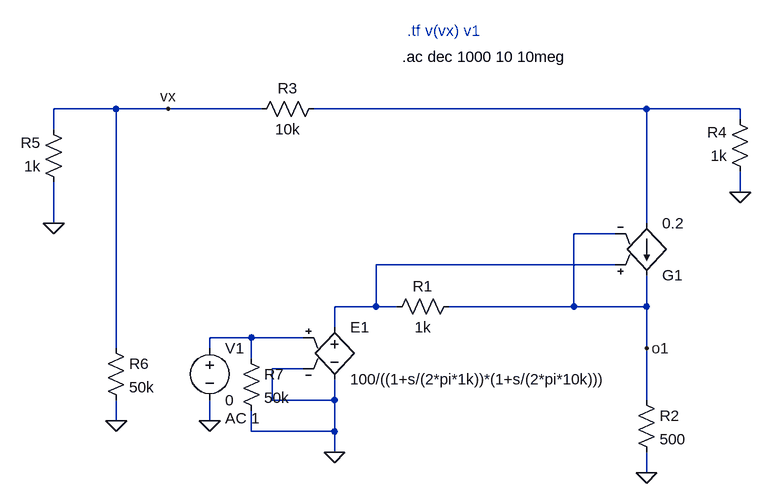
[diagram p0: schematic pruebametodo4.asc]
pruebametodo4.asc, the LTspice schematic file:
Version 4
SHEET 1 1112 1092
WIRE -96 -208 -192 -208
WIRE -16 -208 -96 -208
WIRE 128 -208 -16 -208
WIRE 720 -208 208 -208
WIRE 864 -208 720 -208
WIRE 864 -192 864 -208
WIRE -192 -176 -192 -208
WIRE 864 -80 864 -112
WIRE -192 -32 -192 -96
WIRE 720 -32 720 -208
WIRE 672 -16 608 -16
WIRE 672 32 304 32
WIRE 304 96 304 32
WIRE 304 96 240 96
WIRE 336 96 304 96
WIRE 608 96 608 -16
WIRE 608 96 416 96
WIRE 720 96 720 48
WIRE 720 96 608 96
WIRE 240 128 240 96
WIRE 112 144 48 144
WIRE 192 144 112 144
WIRE -96 160 -96 -208
WIRE 48 160 48 144
WIRE 720 160 720 96
WIRE 112 176 112 144
WIRE 192 192 144 192
WIRE 144 240 144 192
WIRE 240 240 240 208
WIRE 240 240 144 240
WIRE 720 240 720 160
WIRE -96 272 -96 240
WIRE 48 272 48 240
WIRE 112 288 112 256
WIRE 240 288 240 240
WIRE 240 288 112 288
WIRE 240 320 240 288
WIRE 720 352 720 320
FLAG 240 320 0
FLAG 720 352 0
FLAG 720 160 o1
FLAG -192 -32 0
FLAG 864 -80 0
FLAG -96 272 0
FLAG 48 272 0
FLAG -16 -208 vx
SYMBOL e 240 112 R0
SYMATTR InstName E1
SYMATTR Value 100/((1+s/(2*pi*1k))*(1+s/(2*pi*10k)))
SYMATTR SpiceModel laplace
SYMBOL res 320 112 R270
WINDOW 0 32 56 VTop 2
WINDOW 3 0 56 VBottom 2
SYMATTR InstName R1
SYMATTR Value 1k
SYMBOL g 720 64 M180
SYMATTR InstName G1
SYMATTR Value 0.2
SYMBOL res 704 224 R0
SYMATTR InstName R2
SYMATTR Value 500
SYMBOL res -176 -80 R180
WINDOW 0 36 76 Left 2
WINDOW 3 36 40 Left 2
SYMATTR InstName R5
SYMATTR Value 1k
SYMBOL res -112 144 R0
SYMATTR InstName R6
SYMATTR Value 50k
SYMBOL res 224 -224 R90
WINDOW 0 0 56 VBottom 2
WINDOW 3 32 56 VTop 2
SYMATTR InstName R3
SYMATTR Value 10k
SYMBOL res 880 -96 R180
WINDOW 0 36 76 Left 2
WINDOW 3 36 40 Left 2
SYMATTR InstName R4
SYMATTR Value 1k
SYMBOL voltage 48 144 R0
WINDOW 123 24 124 Left 2
WINDOW 39 0 0 Left 0
SYMATTR Value2 AC 1
SYMATTR InstName V1
SYMATTR Value 0
SYMBOL res 96 160 R0
SYMATTR InstName R7
SYMATTR Value 50k
TEXT 352 -328 Left 2 ;.tf v(vx) v1
TEXT 344 -288 Left 2 !.ac dec 1000 10 10meg

The netlist it stands for:
* pruebametodo4.asc
E1 N002 0 N003 0 laplace 100/((1+s/(2*pi*1k))*(1+s/(2*pi*10k)))
R1 N002 o1 1k
G1 N001 o1 N002 o1 0.2
R2 o1 0 500
R5 0 vx 1k
R6 vx 0 50k
R3 N001 vx 10k
R4 0 N001 1k
V1 N003 0 0 AC 1
R7 N003 0 50k
* .tf v(vx) v1
.ac dec 1000 10 10meg
.backanno
.end